# EasyEDA schematic SCH_UWB_2026-08-28.json
TITLE: Sheet_1; REV: 1.0; Date: 2026-08-28; Sheet: 1/1; Drawn By: serane; Company: Your Company
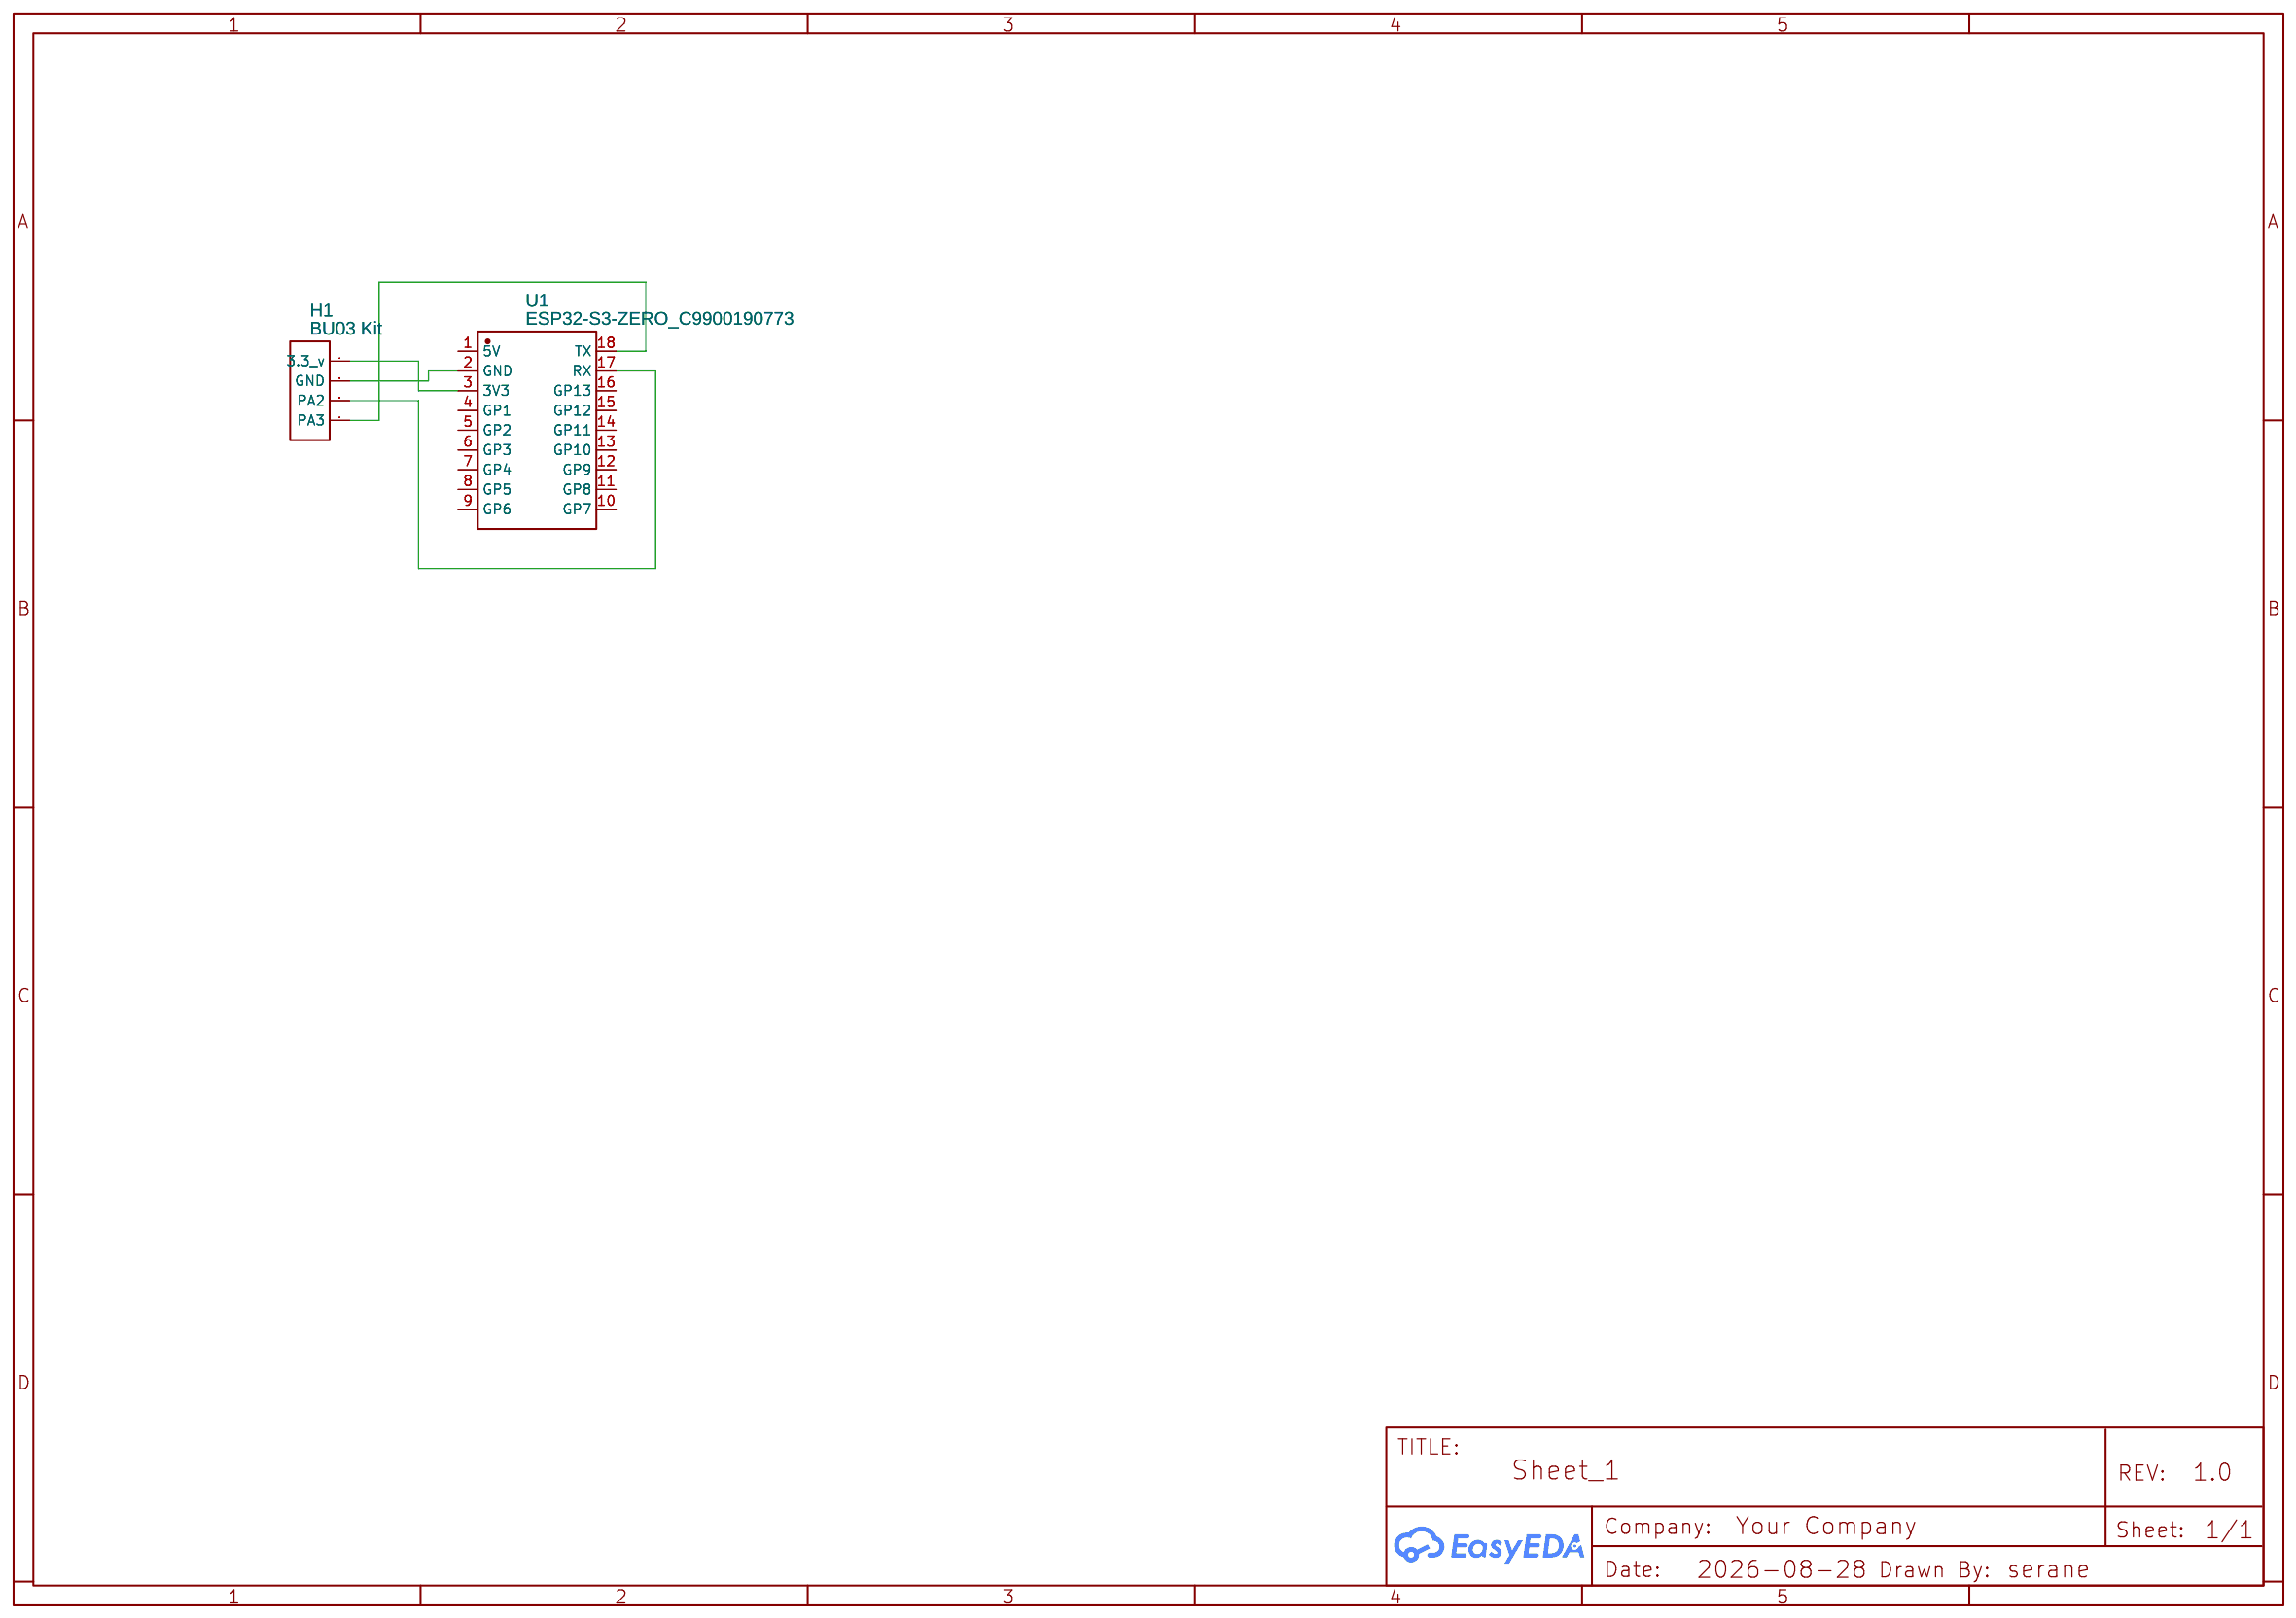
[diagram p0: schematic sheet]

## Parts
H1  BU03 Kit  [HDR-F-2.54_1X4]
U1  ESP32-S3-ZERO_C9900190773  [COMM-SMD_18P-L24.5-W17.8-P2.54_ESP32-S3-ZERO]

## Library data of the parts
H1 = HDR-F-2.54_1x4: Supplier Part: C225501; Supplier: LCSC; Contributor: LCEDA_Lib
U1 = ESP32-S3-ZERO_C9900190773: Supplier: LCSC; Supplier Part: C9900190773; Manufacturer: null; Manufacturer Part: ESP32-S3-Zero; JLCPCB Part Class: Extended Part; Contributor: lcsc

## Nets
Net-(H1-1): H1.1(PA3) U1.18(TX)
Net-(H1-2): H1.2(PA2) U1.17(RX)
Net-(H1-3): H1.3(GND) U1.2(GND)
Net-(H1-4): H1.4(3.3 v) U1.3(3V3)

Not connected (* = marked no-connect by the designer): U1 1(5V) 4(GP1) 5(GP2) 6(GP3) 7(GP4) 8(GP5) 9(GP6) 10(GP7) 11(GP8) 12(GP9) 13(GP10) 14(GP11) 15(GP12) 16(GP13)
